# Altium schematic sheet SSI2130.SchDoc
size Letter
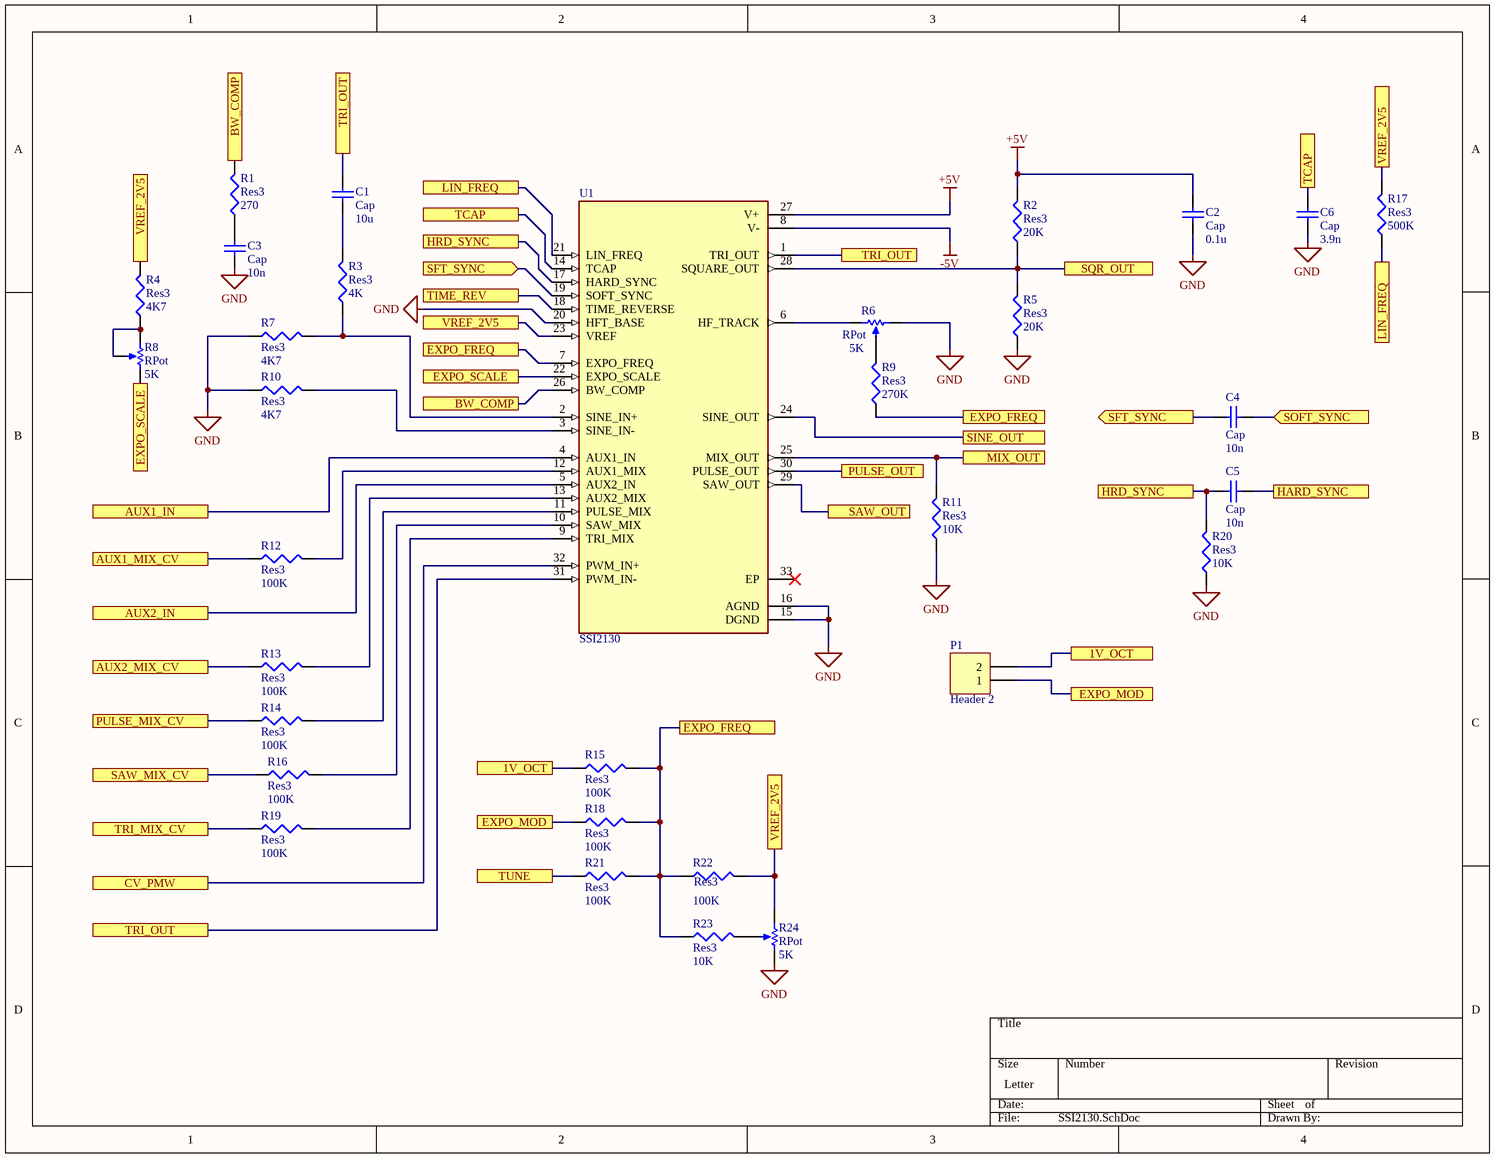
[diagram p0: SSI2130.SchDoc]

## Parts
C1  Cap  value 10u  [RAD-0.3]
C2  Cap  value 0.1u  [RAD-0.3]
C3  Cap  value 10n  [RAD-0.3]
C4  Cap  value 10n  [RAD-0.3]
C5  Cap  value 10n  [RAD-0.3]
C6  Cap  value 3.9n  [RAD-0.3]
P1  Header 2  [HDR1X2]
R1  Res3  value 270  [J1-0603]
R2  Res3  value 20K  [J1-0603]
R3  Res3  value 4K  [J1-0603]
R4  Res3  value 4K7  [J1-0603]
R5  Res3  value 20K  [J1-0603]
R6  RPot  value 5K  [VR5]
R7  Res3  value 4K7  [J1-0603]
R8  RPot  value 5K  [VR5]
R9  Res3  value 270K  [J1-0603]
R10  Res3  value 4K7  [J1-0603]
R11  Res3  value 10K  [J1-0603]
R12  Res3  value 100K  [J1-0603]
R13  Res3  value 100K  [J1-0603]
R14  Res3  value 100K  [J1-0603]
R15  Res3  value 100K  [J1-0603]
R16  Res3  value 100K  [J1-0603]
R17  Res3  value 500K  [J1-0603]
R18  Res3  value 100K  [J1-0603]
R19  Res3  value 100K  [J1-0603]
R20  Res3  value 10K  [J1-0603]
R21  Res3  value 100K  [J1-0603]
R22  Res3  value 100K  [J1-0603]
R23  Res3  value 10K  [J1-0603]
R24  RPot  value 5K  [VR5]
U1  SSI2130  [QFN40P400X400X90-33N]

## Ports
1V_OCT, AUX1_IN, AUX1_MIX_CV, AUX2_IN, AUX2_MIX_CV, BW_COMP, CV_PMW, EXPO_FREQ, EXPO_MOD, EXPO_SCALE, HARD_SYNC, HRD_SYNC, LIN_FREQ, MIX_OUT, PULSE_MIX_CV, PULSE_OUT, SAW_MIX_CV, SAW_OUT, SFT_SYNC (in), SFT_SYNC (out), SINE_OUT, SOFT_SYNC (in), SQR_OUT, TCAP, TIME_REV, TRI_MIX_CV, TRI_OUT, TUNE, VREF_2V5

## Nets
+5V: C2.2 R2.2 U1.27(V+)
-5V: U1.8(V-)
GND: C2.1 C3.1 C6.1 R5.1 R6.2(BOT) R7.1 R10.1 R11.1 R20.1 R24.2(BOT) U1.15(DGND) U1.16(AGND) U1.20(HFT_BASE)
1V_OCT: P1.2 R15.1 ; port 1V_OCT
AUX1_IN: U1.4(AUX1_IN) ; port AUX1_IN
AUX1_MIX_CV: R12.1 ; port AUX1_MIX_CV
AUX2_IN: U1.5(AUX2_IN) ; port AUX2_IN
AUX2_MIX_CV: R13.1 ; port AUX2_MIX_CV
BW_COMP: R1.2 U1.26(BW_COMP) ; port BW_COMP
CV_PMW: U1.32(PWM_IN+) ; port CV_PMW
EXPO_FREQ: R9.1 R15.2 R18.2 R21.2 R22.1 R23.1 U1.7(EXPO_FREQ) ; port EXPO_FREQ
EXPO_MOD: P1.1 R18.1 ; port EXPO_MOD
EXPO_SCALE: R8.2(BOT) U1.22(EXPO_SCALE) ; port EXPO_SCALE
HARD_SYNC: C5.2 ; port HARD_SYNC
HRD_SYNC: C5.1 R20.2 U1.17(HARD_SYNC) ; port HRD_SYNC
LIN_FREQ: R17.1 U1.21(LIN_FREQ) ; port LIN_FREQ
MIX_OUT: R11.2 U1.25(MIX_OUT) ; port MIX_OUT
PULSE_MIX_CV: R14.1 ; port PULSE_MIX_CV
PULSE_OUT: U1.30(PULSE_OUT) ; port PULSE_OUT
SAW_MIX_CV: R16.1 ; port SAW_MIX_CV
SAW_OUT: U1.29(SAW_OUT) ; port SAW_OUT
SFT_SYNC: C4.1 U1.19(SOFT_SYNC) ; port SFT_SYNC
SINE_OUT: U1.24(SINE_OUT) ; port SINE_OUT
SOFT_SYNC: C4.2 ; port SOFT_SYNC
SQR_OUT: R2.1 R5.2 U1.28(SQUARE_OUT) ; port SQR_OUT
TCAP: C6.2 U1.14(TCAP) ; port TCAP
TIME_REV: U1.18(TIME_REVERSE) ; port TIME_REV
TRI_MIX_CV: R19.1 ; port TRI_MIX_CV
TRI_OUT: C1.2 U1.1(TRI_OUT) U1.31(PWM_IN-) ; port TRI_OUT
TUNE: R21.1 ; port TUNE
VREF_2V5: R4.2 R17.2 R22.2 R24.1(TOP) U1.23(VREF) ; port VREF_2V5
NetC1_1: C1.1 R3.2
NetC3_2: C3.2 R1.1
NetR3_1: R3.1 R7.2 U1.2(SINE_IN+)
NetR4_1: R4.1 R8.1(TOP) R8.3(TAP)
NetR6_1: R6.1(TOP) U1.6(HF_TRACK)
NetR6_3: R6.3(TAP) R9.2
NetR10_2: R10.2 U1.3(SINE_IN-)
NetR12_2: R12.2 U1.12(AUX1_MIX)
NetR13_2: R13.2 U1.13(AUX2_MIX)
NetR14_2: R14.2 U1.11(PULSE_MIX)
NetR16_2: R16.2 U1.10(SAW_MIX)
NetR19_2: R19.2 U1.9(TRI_MIX)
NetR23_2: R23.2 R24.3(TAP)

Not connected (* = marked no-connect by the designer): U1 33(EP)*

## Library data of the parts
C1-C6 = Cap: Capacitor; Published: 8-Jun-2000; LatestRevisionDate: 17-Jul-2002; LatestRevisionNote: Re-released for DXP Platform.; PackageReference: RAD-0.3; Publisher: Altium Limited; PackageDescription: Radial Cap, Thru-Hole; 2 Leads; 0.3 in Pin Spacing
P1 = Header 2: Header, 2-Pin; LatestRevisionDate: 17-Jul-2002; LatestRevisionNote: Re-released for DXP Platform.; Publisher: Altium Limited
R1-R5 R7 R9-R23 = Res3: Resistor; Published: 8-Jun-2000; LatestRevisionDate: 29-May-2009; LatestRevisionNote: IPC-7351 Footprint Added.; PackageReference: J1-0603; Publisher: Altium Limited; PackageDescription: Chip Resistor
R6 R8 R24 = RPot: Potentiometer; Sim Note: Enter the Resistance value and the set point into parameter fields.; Set Position: 0.5; Published: 8-Jun-2000; LatestRevisionDate: 17-Jul-2002; LatestRevisionNote: Re-released for DXP Platform.; PackageReference: VR5; Publisher: Altium Limited; PackageDescription: Variable Resistor, Thru-Hole; 3 Leads
U1 = SSI2130: Voltage controlled oscillator subsystem for high-performance electronic musical instruments; MF: Sound Semiconductor; Check_prices: https://www.snapeda.com/parts/SSI2130/Sound%20Semiconductor/view-part/5718733/?ref=eda; SnapEDA_Link: https://www.snapeda.com/parts/SSI2130/Sound%20Semiconductor/view-part/5718733/?ref=snap; Price: None; MP: SSI2130; Value: *; Availability: Unavailable; Package: Package